# Altium schematic sheet MAIN.SchDoc: MAIN
size A4; Organization: Altium Limited; Address1: L3, 12a Rodborough Rd; Address2: Frenchs Forest; Address3: NSW; Address4: Australia 2086; DocumentNumber: 1; SheetNumber: 1; SheetTotal: 6
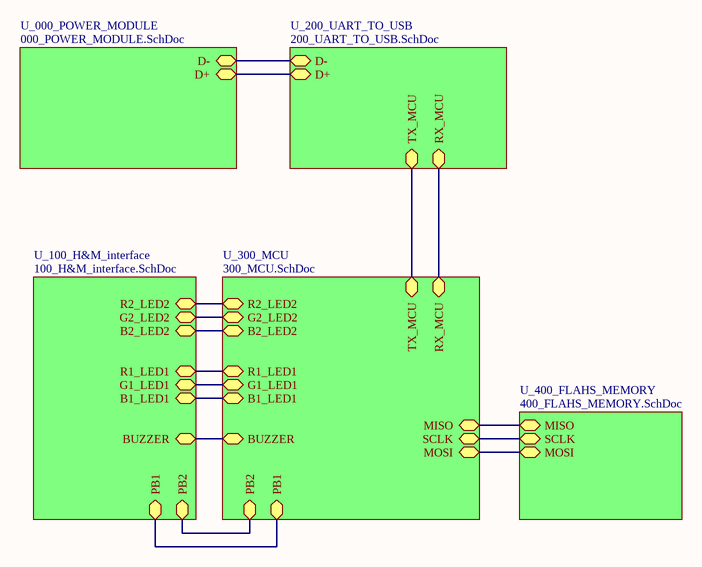
[diagram p0: MAIN.SchDoc]

## Sub-sheets
U_000_POWER_MODULE = 000_POWER_MODULE.SchDoc: D- (bidir), D+ (bidir)
U_100_H&M_interface = 100_H&M_interface.SchDoc: PB1 (bidir), PB2 (bidir), B2_LED2 (bidir), G2_LED2 (bidir), R2_LED2 (bidir), G1_LED1 (bidir), B1_LED1 (bidir), R1_LED1 (bidir), BUZZER (bidir)
U_200_UART_TO_USB = 200_UART_TO_USB.SchDoc: D- (bidir), D+ (bidir), TX_MCU (bidir), RX_MCU (bidir)
U_300_MCU = 300_MCU.SchDoc: SCLK (bidir), MISO (bidir), MOSI (bidir), PB1 (bidir), B2_LED2 (bidir), TX_MCU (bidir), RX_MCU (bidir), R1_LED1 (bidir), G2_LED2 (bidir), R2_LED2 (bidir), G1_LED1 (bidir), B1_LED1 (bidir), PB2 (bidir), BUZZER (bidir)
U_400_FLAHS_MEMORY = 400_FLAHS_MEMORY.SchDoc: MISO (bidir), SCLK (bidir), MOSI (bidir)

## Nets
(unnamed): sheet U_000_POWER_MODULE/D-, sheet U_200_UART_TO_USB/D-
(unnamed): sheet U_000_POWER_MODULE/D+, sheet U_200_UART_TO_USB/D+
(unnamed): sheet U_200_UART_TO_USB/TX_MCU, sheet U_300_MCU/TX_MCU
(unnamed): sheet U_200_UART_TO_USB/RX_MCU, sheet U_300_MCU/RX_MCU
(unnamed): sheet U_100_H&M_interface/PB1, sheet U_300_MCU/PB1
(unnamed): sheet U_100_H&M_interface/PB2, sheet U_300_MCU/PB2
(unnamed): sheet U_100_H&M_interface/B2_LED2, sheet U_300_MCU/B2_LED2
(unnamed): sheet U_100_H&M_interface/G2_LED2, sheet U_300_MCU/G2_LED2
(unnamed): sheet U_100_H&M_interface/R2_LED2, sheet U_300_MCU/R2_LED2
(unnamed): sheet U_100_H&M_interface/G1_LED1, sheet U_300_MCU/G1_LED1
(unnamed): sheet U_100_H&M_interface/B1_LED1, sheet U_300_MCU/B1_LED1
(unnamed): sheet U_100_H&M_interface/R1_LED1, sheet U_300_MCU/R1_LED1
(unnamed): sheet U_100_H&M_interface/BUZZER, sheet U_300_MCU/BUZZER
(unnamed): sheet U_400_FLAHS_MEMORY/MISO, sheet U_300_MCU/MISO
(unnamed): sheet U_400_FLAHS_MEMORY/SCLK, sheet U_300_MCU/SCLK
(unnamed): sheet U_400_FLAHS_MEMORY/MOSI, sheet U_300_MCU/MOSI

## Notes on the sheet
- Title
- Size:
- Date:
- A4
- Number:
- Time:
- Revision:
- Sheet
- of
- File: